# EAGLE design PiezoDriver (EAGLE 7.6.0)
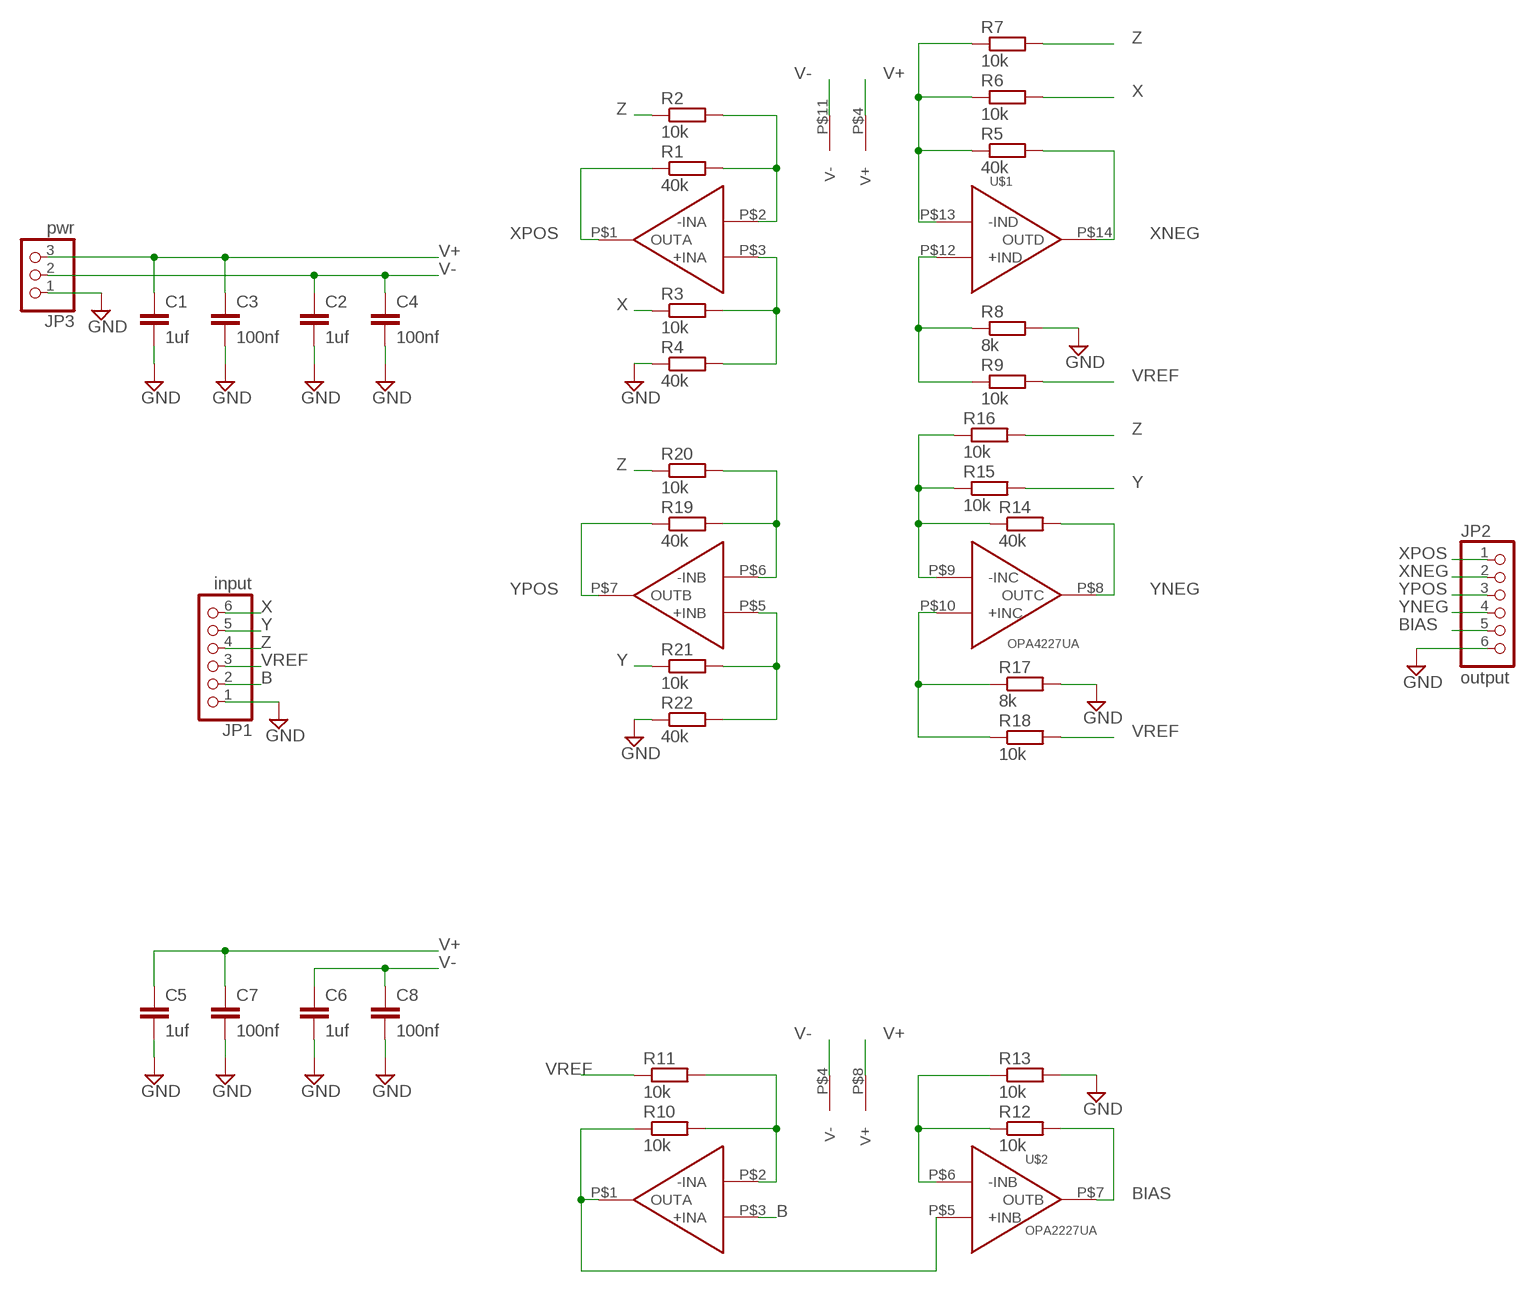
[diagram p0: schematic, sheet 1]

## Parts
C1  1uf  C-EUC0603  [C0603]
C2  1uf  C-EUC0603  [C0603]
C3  100nf  C-EUC0603  [C0603]
C4  100nf  C-EUC0603  [C0603]
C5  1uf  C-EUC0603  [C0603]
C6  1uf  C-EUC0603  [C0603]
C7  100nf  C-EUC0603  [C0603]
C8  100nf  C-EUC0603  [C0603]
JP1  input  PINHD-1X6  [1X06]
JP2  output  PINHD-1X6  [1X06]
JP3  pwr  PINHD-1X3  [1X03]
R1  40k  R-EU_R0603  [R0603]
R2  10k  R-EU_R0603  [R0603]
R3  10k  R-EU_R0603  [R0603]
R4  40k  R-EU_R0603  [R0603]
R5  40k  R-EU_R0603  [R0603]
R6  10k  R-EU_R0603  [R0603]
R7  10k  R-EU_R0603  [R0603]
R8  8k  R-EU_R0603  [R0603]
R9  10k  R-EU_R0603  [R0603]
R10  10k  R-EU_R0603  [R0603]
R11  10k  R-EU_R0603  [R0603]
R12  10k  R-EU_R0603  [R0603]
R13  10k  R-EU_R0603  [R0603]
R14  40k  R-EU_R0603  [R0603]
R15  10k  R-EU_R0603  [R0603]
R16  10k  R-EU_R0603  [R0603]
R17  8k  R-EU_R0603  [R0603]
R18  10k  R-EU_R0603  [R0603]
R19  40k  R-EU_R0603  [R0603]
R20  10k  R-EU_R0603  [R0603]
R21  10k  R-EU_R0603  [R0603]
R22  40k  R-EU_R0603  [R0603]
U$1  OPA4227UA  [SOIC-14]
U$2  OPA2227UA  [SOIC-8]

## Nets
B: JP1.2 U$2.P$3(+INA)
BIAS: JP2.5 R12.2 U$2.P$7(OUTB)
GND: C1.2 C2.2 C3.2 C4.2 C5.2 C6.2 C7.2 C8.2 JP1.1 JP2.6 JP3.1 R4.1 R8.2 R13.2 R17.2 R22.1
N$1: R1.2 R2.2 U$1.P$2(-INA)
N$2: R19.2 R20.2 U$1.P$6(-INB)
N$3: R3.2 R4.2 U$1.P$3(+INA)
N$4: R14.1 R15.1 R16.1 U$1.P$9(-INC)
N$5: R5.1 R6.1 R7.1 U$1.P$13(-IND)
N$6: R8.1 R9.1 U$1.P$12(+IND)
N$7: R10.1 U$2.P$1(OUTA) U$2.P$5(+INB)
N$8: R10.2 R11.2 U$2.P$2(-INA)
N$10: R12.1 R13.1 U$2.P$6(-INB)
N$12: R17.1 R18.1 U$1.P$10(+INC)
N$13: R21.2 R22.2 U$1.P$5(+INB)
V+: C1.1 C3.1 C5.1 C7.1 JP3.3 U$1.P$4(V+) U$2.P$8(V+)
V-: C2.1 C4.1 C6.1 C8.1 JP3.2 U$1.P$11(V-) U$2.P$4(V-)
VREF: JP1.3 R9.2 R11.1 R18.2
X: JP1.6 R3.1 R6.2
XNEG: JP2.2 R5.2 U$1.P$14(OUTD)
XPOS: JP2.1 R1.1 U$1.P$1(OUTA)
Y: JP1.5 R15.2 R21.1
YNEG: JP2.4 R14.2 U$1.P$8(OUTC)
YPOS: JP2.3 R19.1 U$1.P$7(OUTB)
Z: JP1.4 R2.1 R7.2 R16.2 R20.1

## Library data of the parts
C1-C8 = resistor:C-EU: CAPACITOR, European symbol
JP1 JP2 = pinhead:PINHD-1X6: PIN HEADER
JP3 = pinhead:PINHD-1X3: PIN HEADER
R1-R22 = resistor:R-EU_: RESISTOR, European symbol
U$1 = OPAX22X:OPA4227UA
U$2 = OPAX22X:OPA2227UA

## Board
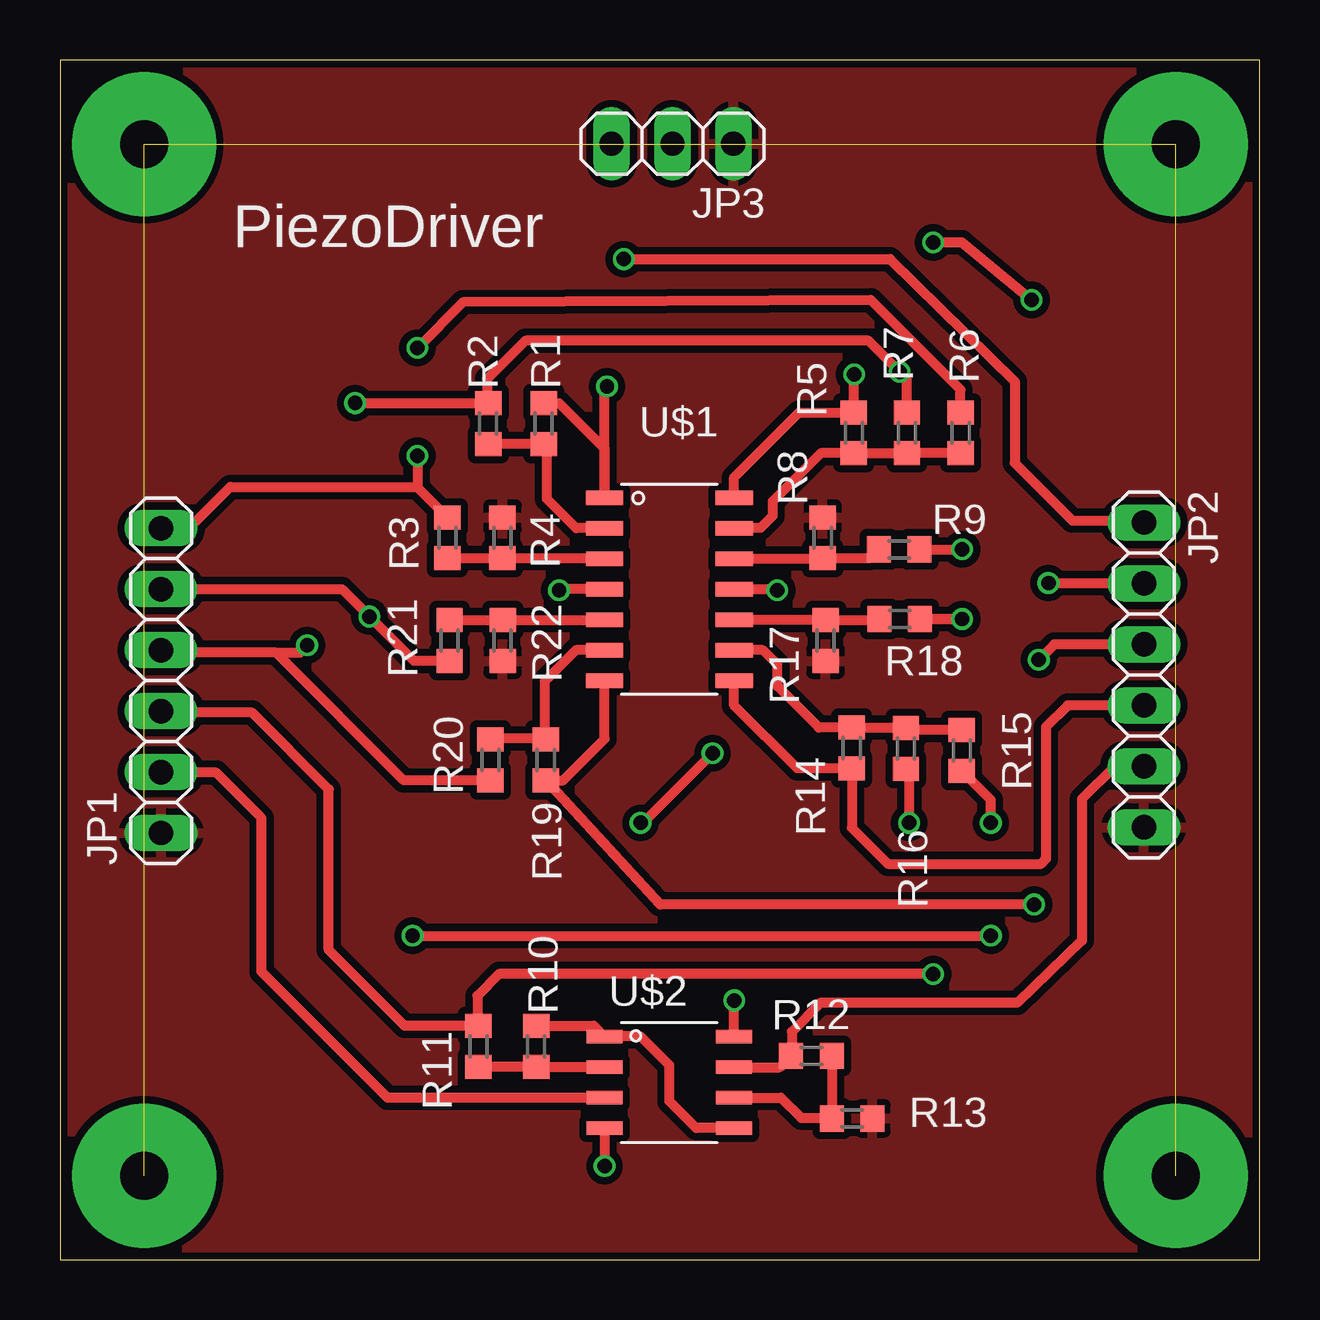
[diagram p1: board, top side]
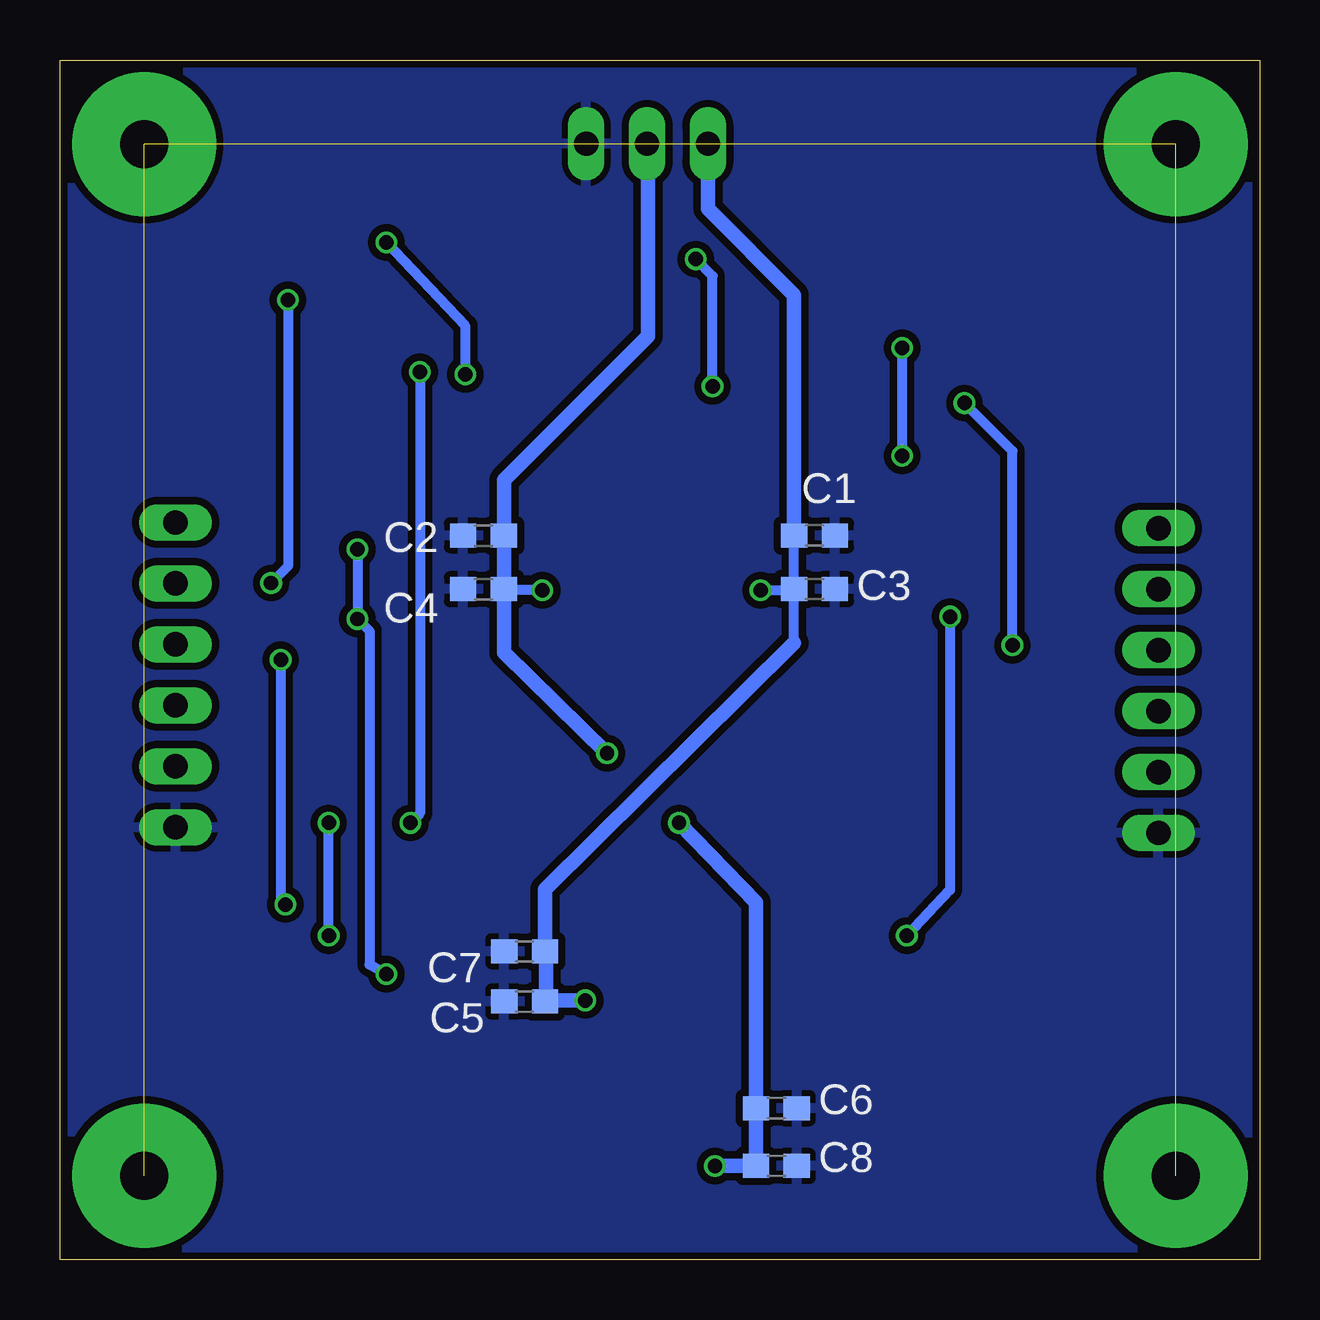
[diagram p2: board, bottom side, seen from below]

Size 50 x 50 mm. Coordinates in mm from the lower left corner, seen from the top.
Outline: 0,0 50,0 50,50 0,50 0,0
Copper layers (1*16): Top 0.035mm / dielectric 1.5mm / Bottom 0.035mm
Design rules "ITead_rule": minimum track width 6mil, minimum drill 12mil, track to track 6mil, track to pad 6mil, pad to pad 6mil, via to via 6mil, smd to smd 0mil, copper to edge 10mil, drill to drill 10mil, minimum pad ring 10mil, minimum via ring 6mil, stop-mask expansion 2mil, vias tented up to drill 100mil, thermal gap 10mil

### Footprints (pad centres in the part's own frame; a part is rotated, then mirrored left to right if it is on the bottom)
C0603 = smd 1.1 x 1: 1 -0.85,0; 2 0.85,0
1X06 = drill 1.016 long: 1 -6.35,0; 2 -3.81,0; 3 -1.27,0; 4 1.27,0; 5 3.81,0; 6 6.35,0
1X03 = drill 1.016 long: 1 -2.54,0; 2 0,0; 3 2.54,0
R0603 = smd 1 x 1.1: 1 -0.85,0; 2 0.85,0
SOIC-14 = smd 1.55 x 0.6: P$1 -2.7,3.81; P$2 -2.7,2.54; P$3 -2.7,1.27; P$4 -2.7,0; P$5 -2.7,-1.27; P$6 -2.7,-2.54; P$7 -2.7,-3.81; P$8 2.7,-3.81; P$9 2.7,-2.54; P$10 2.7,-1.27; P$11 2.7,0; P$12 2.7,1.27; P$13 2.7,2.54; P$14 2.7,3.81
SOIC-8 = smd 1.5 x 0.55: P$1 -2.7,1.27; P$2 -2.7,0; P$3 -2.7,-1.27; P$4 -2.7,-2.54; P$5 2.7,-2.54; P$6 2.7,-1.27; P$7 2.7,0; P$8 2.7,1.27

### Placement (x,y rotation side)
C1  18.55,30.18 0 bottom
C2  32.35,30.18 180 bottom
C3  18.55,27.94 0 bottom
C4  32.35,27.94 180 bottom
C5  30.63,10.76 180 bottom
C6  20.14,6.31 0 bottom
C7  30.63,12.85 180 bottom
C8  20.14,3.9 0 bottom
JP1  4.21,24.13 90 top
JP2  45.18,24.37 270 top
JP3  25.53,46.51 180 top
R1  20.16,34.84 270 top
R2  17.85,34.84 270 top
R3  16.15,30.08 270 top
R4  18.44,30.08 270 top
R5  33.09,34.46 90 top
R6  37.54,34.46 90 top
R7  35.3,34.46 90 top
R8  31.79,30.08 90 top
R9  34.98,29.6 0 top
R10  19.85,8.89 270 top
R11  17.44,8.89 270 top
R12  31.32,8.49 180 top
R13  33.02,5.88 0 top
R14  33,21.32 270 top
R15  37.59,21.22 270 top
R16  35.26,21.3 270 top
R17  31.91,25.8 270 top
R18  35,26.7 0 top
R19  20.25,20.82 90 top
R20  17.94,20.82 90 top
R21  16.24,25.8 90 top
R22  18.45,25.8 90 top
U$1  25.4,27.94 0 top
U$2  25.4,8.02 0 top

### Tracks (layer width: path | path; a pad name or v marks a point on that pad's centre or on a via)
B
  Top 0.406: U$2.P$3 13.65,6.75 8.4,12 8.4,18.4 6.5,20.3 4.23,20.3 JP1.2
BIAS
  Top 0.406: U$2.P$7 30,8.02 R12.2 30.5,8.52 30.5,9.5 31.7,10.7 39.9,10.7 42.6,13.3 42.6,19.2 43.96,20.56 JP2.5
GND
  pour Top (isolate 0.305): 0,50 50,50 50,0 0,0
  pour Bottom (isolate 0.305): 0,50 50,50 50,0 0,0
N$1
  Top 0.406: U$1.P$2 21.52,30.48 20.3,31.7 20.3,33.85 R1.2 R2.2
N$2
  Top 0.406: U$1.P$6 21.5,25.4 20.2,24.1 20.2,21.72 | 20.2,21.72 R19.2 | 20.2,21.72 17.99,21.72 R20.2
N$3
  Top 0.406: R3.2 R4.2 22.68,29.23 U$1.P$3
N$4
  Top 0.406: U$1.P$9 29.3,25.4 29.9,24.8 29.9,23.9 31.63,22.17 R14.1 35.24,22.17 R16.1 35.34,22.07 R15.1
N$5
  Top 0.406: R6.1 R7.1 R5.1 31.71,33.61 29.7,31.6 29.7,31 29.2,30.5 28.12,30.5 U$1.P$13
N$6
  Top 0.406: U$1.P$12 31.77,29.21 R8.1 33.76,29.23 R9.1
N$7
  Top 0.406: R10.1 22.25,9.74 U$2.P$1 24.2,9.3 25.4,8.1 25.4,6.6 26.52,5.48 U$2.P$5
N$8
  Top 0.406: U$2.P$2 22.68,8.04 R10.2 R11.2
N$9  (via drill 2 pad 6)  (3 unrouted)
  other vias: 46.5,46.5 3.5,46.5 3.5,3.5 46.5,3.5
N$10
  Top 0.406: U$2.P$6 30.05,6.75 30.9,5.9 32.05,5.9 R13.1 R12.1
N$12
  Top 0.406: R18.1 34.1,26.65 R17.1 28.12,26.65 U$1.P$10
N$13
  Top 0.406: R21.2 R22.2 22.68,26.65 U$1.P$5
V+  (via drill 0.6)
  Top 0.406: U$1.P$4 20.8,27.94 v20.8,27.9 | U$2.P$8 v28.1,10.8
  Bottom 0.406: v20.8,27.9 19.9,27.9 C3.1 | C3.1 C1.1 | 29.74,10.8 C5.1 | 29.74,12.61 C7.1 | JP3.3 | 19.4,25.7 C3.1
  Bottom 0.61: v28.1,10.8 29.74,10.8 29.74,12.61 | C1.1 19.4,40.2 23,43.8 JP3.3 | C7.1 29.78,15.42 19.4,25.7
V-  (via drill 0.6)
  Top 0.406: U$1.P$11 29.86,27.94 v29.9,27.9 | U$2.P$4 v22.7,3.9 | v24.2,18.2 24.3,18.2 v27.2,21.1
  Bottom 0.406: v29.9,27.9 31.46,27.9 C4.1 | 25.5,46.48 JP3.2
  Bottom 0.61: v22.7,3.9 C8.1 C6.1 20.99,14.89 v24.2,18.2 | 25.5,46.48 25.5,38.5 31.5,32.5 C2.1 C4.1 31.5,25.3 v27.2,21.1
VREF  (via drill 0.6)
  Top 0.406: JP1.3 4.27,22.8 8,22.8 11.2,19.6 11.2,12.9 14.36,9.74 R11.1 17.4,9.78 17.4,11 18.3,11.9 v36.4,11.9 | R9.2 v37.6,29.6 | v37.6,26.7 R18.2 37.5,26.7
  Bottom 0.406: v37.6,29.6 v37.6,26.7 37.1,26.2 37.1,12.3 v36.4,11.9
X  (via drill 0.6)
  Top 0.406: JP1.6 5.38,30.48 7.1,32.2 14.88,32.2 | 14.88,32.2 R3.1 | R6.2 37.54,36.26 33.8,40 16.8,39.9 v14.9,38 | v14.9,33.5 14.9,32.22 14.88,32.2
  Bottom 0.406: v14.9,38 v14.9,33.5
XNEG  (via drill 0.6)
  Top 0.406: U$1.P$14 28.1,32.6 30.8,35.3 R5.2 33.09,36.69 v33.1,36.9 | v36.4,42.4 37.6,42.4 v40.5,40 | v41.2,28.2 45.16,28.2 JP2.2
  Bottom 0.406: v33.1,36.9 33.1,38.9 v36.4,42.4 | v40.5,40 40.5,28.9 v41.2,28.2
XPOS  (via drill 0.6)
  Top 0.406: R1.1 20.81,35.69 22.7,33.8 U$1.P$1 22.7,36.3 v22.8,36.4 | v23.5,41.7 34.6,41.7 39.8,36.6 39.8,33.2 42.2,30.8 45.1,30.8 JP2.1
  Bottom 0.406: v22.8,36.4 22.8,41 v23.5,41.7
Y  (via drill 0.6)
  Top 0.406: JP1.5 11.76,27.94 v12.9,26.8 14.75,24.95 R21.1 | v14.7,13.5 v38.8,13.5 | v38.8,18.2 38.8,19.16 R15.2
  Bottom 0.406: v12.9,26.8 12.9,15.4 v14.7,13.5 | v38.8,13.5 v38.8,18.2 38.8,18.3
YNEG
  Top 0.406: U$1.P$8 28.1,23.1 30.73,20.47 R14.2 33,18 34.5,16.5 40.9,16.5 41.1,16.7 41.1,22.2 42,23.1 JP2.4
YPOS  (via drill 0.6)
  Top 0.406: U$1.P$7 22.7,21.7 20.97,19.97 R19.1 25.02,14.8 v40.6,14.8 | JP2.3 41.44,25.64 v40.8,25
  Bottom 0.406: v40.8,25 40.8,15 v40.6,14.8
Z  (via drill 0.6)
  Top 0.406: R7.2 35.3,36.7 v35,37 33.7,38.3 19.4,38.3 17.8,36.7 17.8,35.74 R2.1 v12.3,35.7 | v35.4,18.2 35.4,20.31 R16.2 | R20.1 14.33,19.97 9,25.3 | 9,25.3 4.31,25.3 JP1.4 | 9,25.3 10,25.3 v10.3,25.6
  Bottom 0.406: v35,37 35,18.6 v35.4,18.2 | v10.3,25.6 10.3,33.7 v12.3,35.7

### Text on the board
tPlace: PiezoDriver